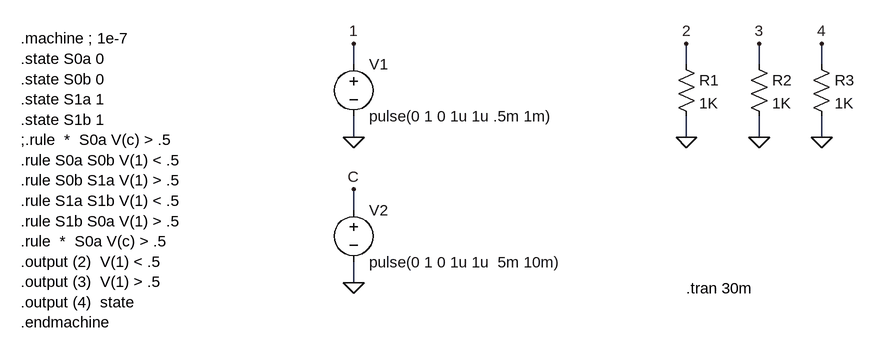
[diagram p0: schematic builtin_00_divide2.asc]
builtin_00_divide2.asc, the LTspice schematic file:
Version 4
SHEET 1 1004 812
WIRE 224 416 224 384
WIRE 736 416 736 384
WIRE 848 416 848 384
WIRE 944 416 944 384
WIRE 224 528 224 496
WIRE 736 528 736 496
WIRE 848 528 848 496
WIRE 944 528 944 496
WIRE 224 640 224 608
WIRE 224 752 224 720
FLAG 224 528 0
FLAG 736 528 0
FLAG 224 384 1
FLAG 736 384 2
FLAG 848 528 0
FLAG 848 384 3
FLAG 944 528 0
FLAG 944 384 4
FLAG 224 752 0
FLAG 224 608 C
SYMBOL voltage 224 400 R0
SYMATTR InstName V1
SYMATTR Value pulse(0 1 0 1u 1u .5m 1m)
SYMBOL res 720 400 R0
SYMATTR InstName R1
SYMATTR Value 1K
SYMBOL res 832 400 R0
SYMATTR InstName R2
SYMATTR Value 1K
SYMBOL res 928 400 R0
SYMATTR InstName R3
SYMATTR Value 1K
SYMBOL voltage 224 624 R0
SYMATTR InstName V2
SYMATTR Value pulse(0 1 0 1u 1u  5m 10m)
TEXT -288 376 Left 2 !.machine ; 1e-7\n.state S0a 0\n.state S0b 0\n.state S1a 1\n.state S1b 1\n;.rule  *  S0a V(c) > .5\n.rule S0a S0b V(1) < .5\n.rule S0b S1a V(1) > .5\n.rule S1a S1b V(1) < .5\n.rule S1b S0a V(1) > .5\n.rule  *  S0a V(c) > .5\n.output (2)  V(1) < .5\n.output (3)  V(1) > .5\n.output (4)  state\n.endmachine
TEXT 736 760 Left 2 !.tran 30m

The netlist it stands for:
* builtin_00_divide2.asc
V1 1 0 pulse(0 1 0 1u 1u .5m 1m)
R1 2 0 1K
R2 3 0 1K
R3 4 0 1K
V2 C 0 pulse(0 1 0 1u 1u  5m 10m)
.machine ; 1e-7
.state S0a 0
.state S0b 0
.state S1a 1
.state S1b 1
;.rule  *  S0a V(c) > .5
.rule S0a S0b V(1) < .5
.rule S0b S1a V(1) > .5
.rule S1a S1b V(1) < .5
.rule S1b S0a V(1) > .5
.rule  *  S0a V(c) > .5
.output (2)  V(1) < .5
.output (3)  V(1) > .5
.output (4)  state
.endmachine
.tran 30m
.backanno
.end